# Altium schematic sheet PCIe_X16.SchDoc
size A3
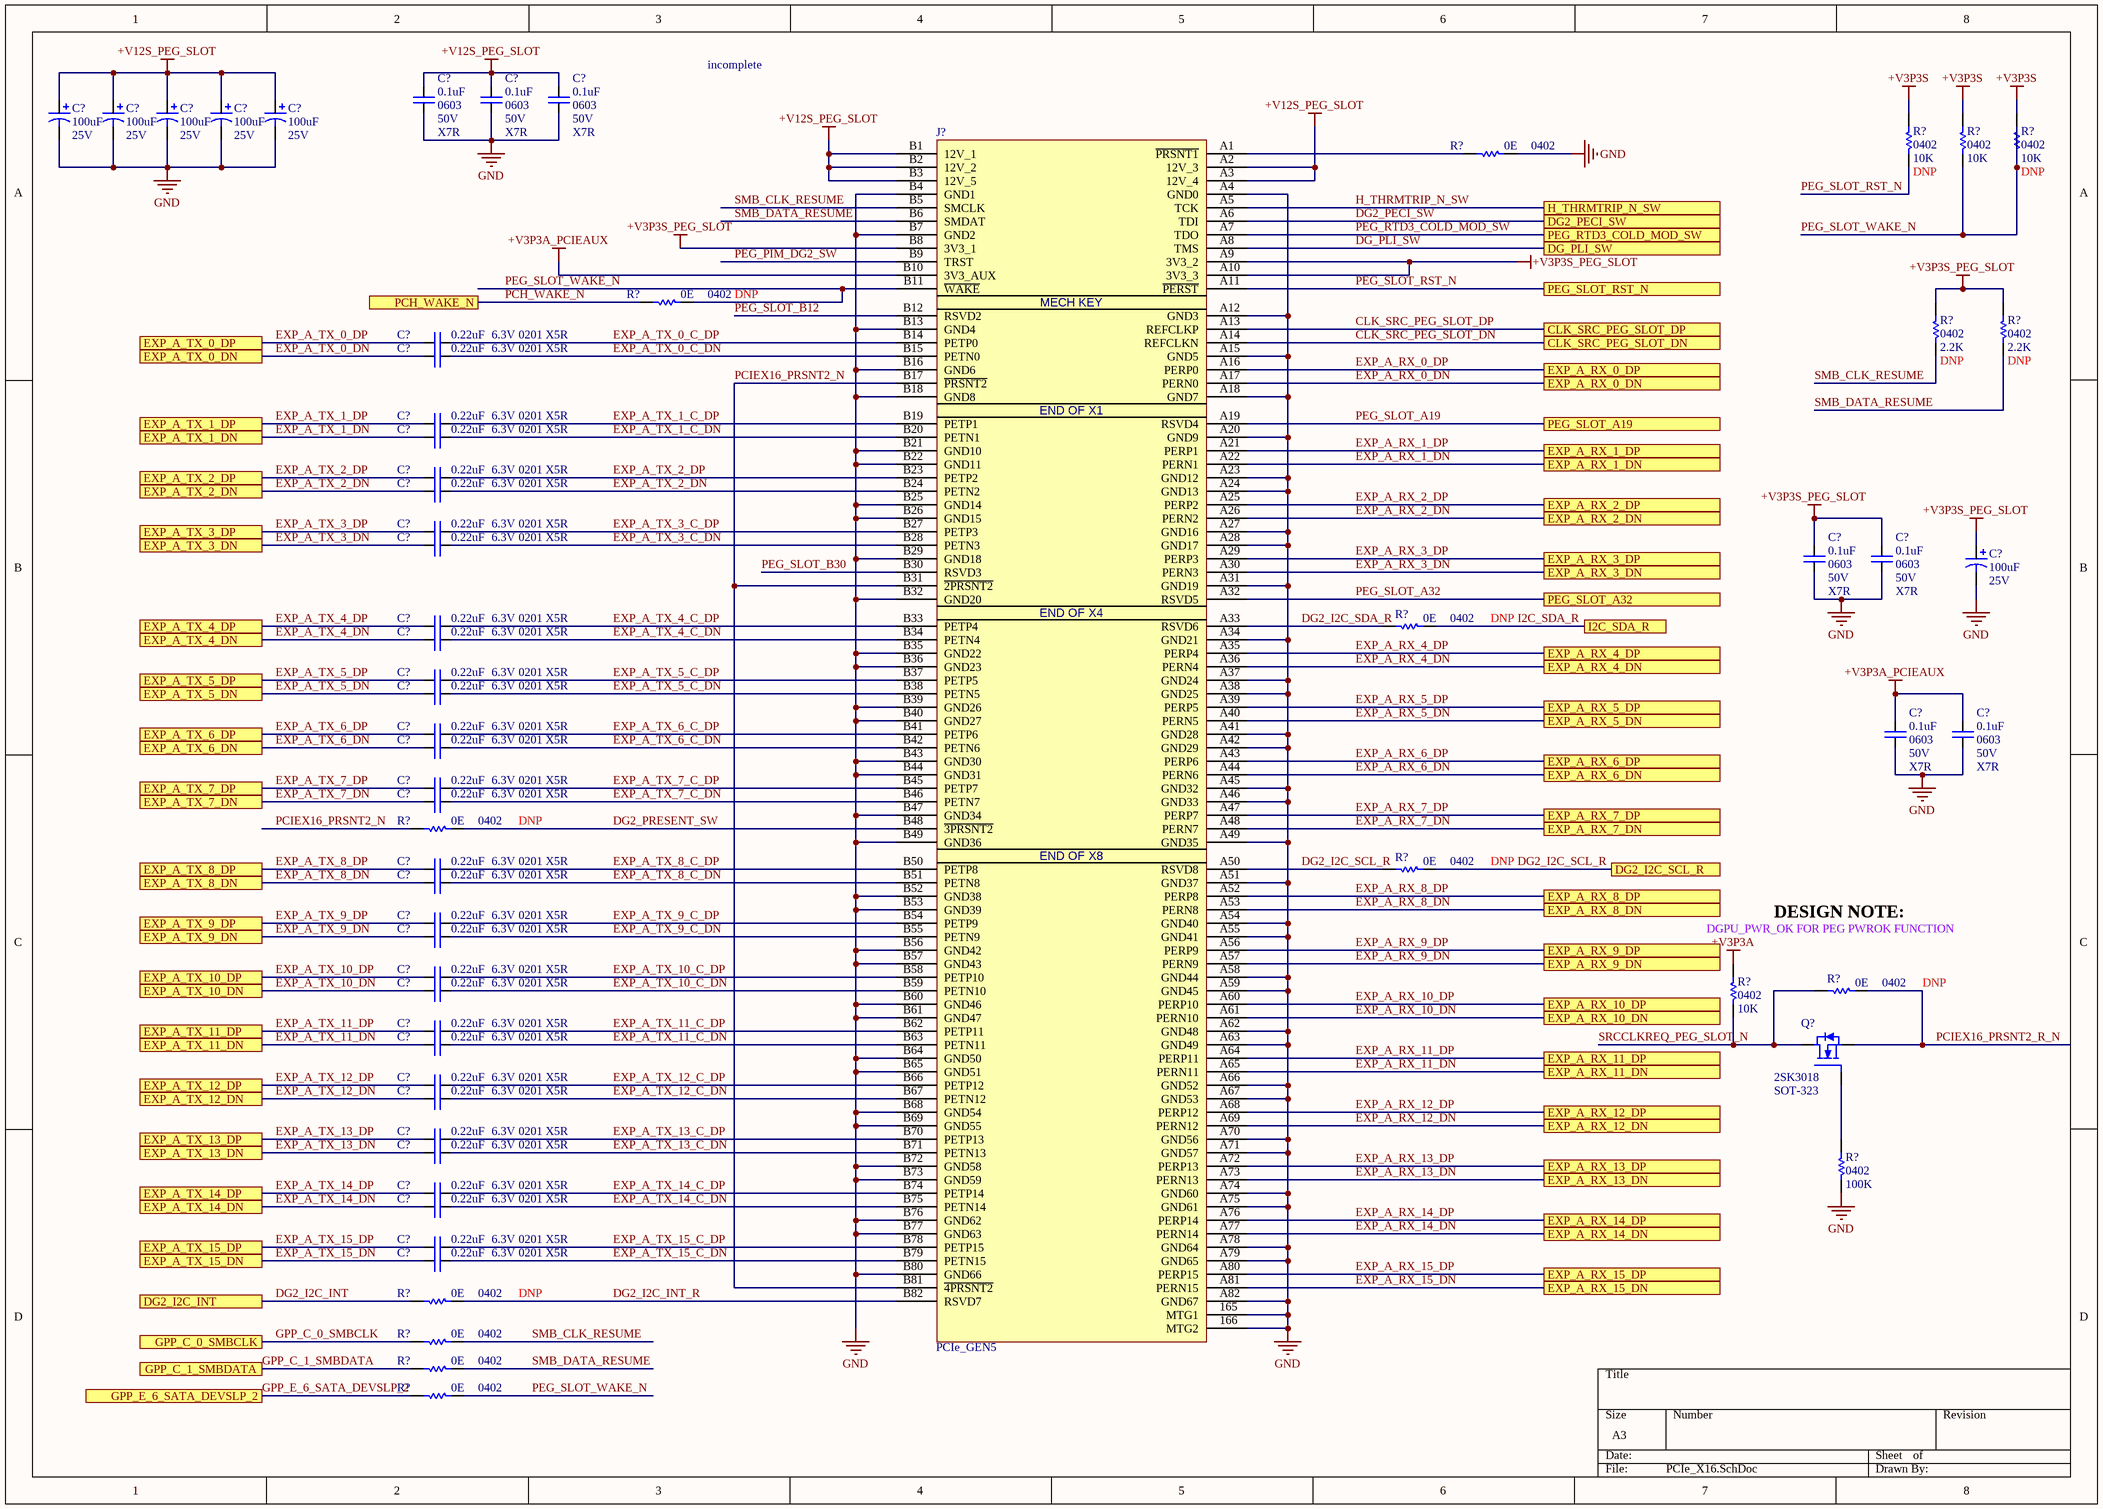
[diagram p0: PCIe_X16.SchDoc]

## Parts
(Parts that share a designator on the sheet are numbered #1, #2 ... from top to bottom, then left to right.)
C?#1  value 100uF  Voltage: 25V  (hidden comment: cap_polar)
C?#2  value 100uF  Voltage: 25V  (hidden comment: cap_polar)
C?#3  value 100uF  Voltage: 25V  (hidden comment: cap_polar)
C?#4  value 100uF  Voltage: 25V  (hidden comment: cap_polar)
C?#5  value 100uF  Voltage: 25V  (hidden comment: cap_polar)
C?#6  value 0.1uF  Case/Package: 0603  Voltage: 50V  Dielectric: X7R  [CAPC0201]
C?#7  value 0.1uF  Case/Package: 0603  Voltage: 50V  Dielectric: X7R  [CAPC0201]
C?#8  value 0.1uF  Case/Package: 0603  Voltage: 50V  Dielectric: X7R  [CAPC0201]
C?#9  value 0.22uF  Case/Package: 0201  Voltage: 6.3V  Dielectric: X5R  [CAPC0201]
C?#10  value 0.22uF  Case/Package: 0201  Voltage: 6.3V  Dielectric: X5R  [CAPC0201]
C?#11  value 0.22uF  Case/Package: 0201  Voltage: 6.3V  Dielectric: X5R  [CAPC0201]
C?#12  value 0.22uF  Case/Package: 0201  Voltage: 6.3V  Dielectric: X5R  [CAPC0201]
C?#13  value 0.22uF  Case/Package: 0201  Voltage: 6.3V  Dielectric: X5R  [CAPC0201]
C?#14  value 0.22uF  Case/Package: 0201  Voltage: 6.3V  Dielectric: X5R  [CAPC0201]
C?#15  value 0.22uF  Case/Package: 0201  Voltage: 6.3V  Dielectric: X5R  [CAPC0201]
C?#16  value 0.22uF  Case/Package: 0201  Voltage: 6.3V  Dielectric: X5R  [CAPC0201]
C?#17  value 100uF  Voltage: 25V  (hidden comment: cap_polar)
C?#18  value 0.1uF  Case/Package: 0603  Voltage: 50V  Dielectric: X7R  [CAPC0201]
C?#19  value 0.1uF  Case/Package: 0603  Voltage: 50V  Dielectric: X7R  [CAPC0201]
C?#20  value 0.22uF  Case/Package: 0201  Voltage: 6.3V  Dielectric: X5R  [CAPC0201]
C?#21  value 0.22uF  Case/Package: 0201  Voltage: 6.3V  Dielectric: X5R  [CAPC0201]
C?#22  value 0.22uF  Case/Package: 0201  Voltage: 6.3V  Dielectric: X5R  [CAPC0201]
C?#23  value 0.22uF  Case/Package: 0201  Voltage: 6.3V  Dielectric: X5R  [CAPC0201]
C?#24  value 0.22uF  Case/Package: 0201  Voltage: 6.3V  Dielectric: X5R  [CAPC0201]
C?#25  value 0.1uF  Case/Package: 0603  Voltage: 50V  Dielectric: X7R  [CAPC0201]
C?#26  value 0.1uF  Case/Package: 0603  Voltage: 50V  Dielectric: X7R  [CAPC0201]
C?#27  value 0.22uF  Case/Package: 0201  Voltage: 6.3V  Dielectric: X5R  [CAPC0201]
C?#28  value 0.22uF  Case/Package: 0201  Voltage: 6.3V  Dielectric: X5R  [CAPC0201]
C?#29  value 0.22uF  Case/Package: 0201  Voltage: 6.3V  Dielectric: X5R  [CAPC0201]
C?#30  value 0.22uF  Case/Package: 0201  Voltage: 6.3V  Dielectric: X5R  [CAPC0201]
C?#31  value 0.22uF  Case/Package: 0201  Voltage: 6.3V  Dielectric: X5R  [CAPC0201]
C?#32  value 0.22uF  Case/Package: 0201  Voltage: 6.3V  Dielectric: X5R  [CAPC0201]
C?#33  value 0.22uF  Case/Package: 0201  Voltage: 6.3V  Dielectric: X5R  [CAPC0201]
C?#34  value 0.22uF  Case/Package: 0201  Voltage: 6.3V  Dielectric: X5R  [CAPC0201]
C?#35  value 0.22uF  Case/Package: 0201  Voltage: 6.3V  Dielectric: X5R  [CAPC0201]
C?#36  value 0.22uF  Case/Package: 0201  Voltage: 6.3V  Dielectric: X5R  [CAPC0201]
C?#37  value 0.22uF  Case/Package: 0201  Voltage: 6.3V  Dielectric: X5R  [CAPC0201]
C?#38  value 0.22uF  Case/Package: 0201  Voltage: 6.3V  Dielectric: X5R  [CAPC0201]
C?#39  value 0.22uF  Case/Package: 0201  Voltage: 6.3V  Dielectric: X5R  [CAPC0201]
C?#40  value 0.22uF  Case/Package: 0201  Voltage: 6.3V  Dielectric: X5R  [CAPC0201]
C?#41  value 0.22uF  Case/Package: 0201  Voltage: 6.3V  Dielectric: X5R  [CAPC0201]
C?#42  value 0.22uF  Case/Package: 0201  Voltage: 6.3V  Dielectric: X5R  [CAPC0201]
C?#43  value 0.22uF  Case/Package: 0201  Voltage: 6.3V  Dielectric: X5R  [CAPC0201]
C?#44  value 0.22uF  Case/Package: 0201  Voltage: 6.3V  Dielectric: X5R  [CAPC0201]
C?#45  value 0.22uF  Case/Package: 0201  Voltage: 6.3V  Dielectric: X5R  [CAPC0201]
J?  PCIe_GEN5
Q?  Manufacturer Part Number: 2SK3018  Case/Package: SOT-323  [SOT323]  (hidden comment: MOSFET N_2SK3018)
R?#1  value 10K  Case/Package: 0402  [RESC0402]  (hidden comment: Res)
R?#2  value 10K  Case/Package: 0402  [RESC0402]  (hidden comment: Res)
R?#3  value 10K  Case/Package: 0402  [RESC0402]  (hidden comment: Res)
R?#4  value 0E  Case/Package: 0402  [RESC0402]  (hidden comment: Res)
R?#5  value 0E  Case/Package: 0402  [RESC0402]  (hidden comment: Res)
R?#6  value 2.2K  Case/Package: 0402  [RESC0402]  (hidden comment: Res)
R?#7  value 2.2K  Case/Package: 0402  [RESC0402]  (hidden comment: Res)
R?#8  value 0E  Case/Package: 0402  [RESC0402]  (hidden comment: Res)
R?#9  value 0E  Case/Package: 0402  [RESC0402]  (hidden comment: Res)
R?#10  value 0E  Case/Package: 0402  [RESC0402]  (hidden comment: Res)
R?#11  value 10K  Case/Package: 0402  [RESC0402]  (hidden comment: Res)
R?#12  value 0E  Case/Package: 0402  [RESC0402]  (hidden comment: Res)
R?#13  value 100K  Case/Package: 0402  [RESC0402]  (hidden comment: Res)
R?#14  value 0E  Case/Package: 0402  [RESC0402]  (hidden comment: Res)
R?#15  value 0E  Case/Package: 0402  [RESC0402]  (hidden comment: Res)
R?#16  value 0E  Case/Package: 0402  [RESC0402]  (hidden comment: Res)
R?#17  value 0E  Case/Package: 0402  [RESC0402]  (hidden comment: Res)

## Ports
CLK_SRC_PEG_SLOT_DN, CLK_SRC_PEG_SLOT_DP, DG2_I2C_INT, DG2_I2C_SCL_R, DG2_PECI_SW, DG_PLI_SW, EXP_A_RX_0_DN, EXP_A_RX_0_DP, EXP_A_RX_1_DN, EXP_A_RX_1_DP, EXP_A_RX_2_DN, EXP_A_RX_2_DP, EXP_A_RX_3_DN, EXP_A_RX_3_DP, EXP_A_RX_4_DN, EXP_A_RX_4_DP, EXP_A_RX_5_DN, EXP_A_RX_5_DP, EXP_A_RX_6_DN, EXP_A_RX_6_DP, EXP_A_RX_7_DN, EXP_A_RX_7_DP, EXP_A_RX_8_DN, EXP_A_RX_8_DP, EXP_A_RX_9_DN, EXP_A_RX_9_DP, EXP_A_RX_10_DN, EXP_A_RX_10_DP, EXP_A_RX_11_DN, EXP_A_RX_11_DP, EXP_A_RX_12_DN, EXP_A_RX_12_DP, EXP_A_RX_13_DN, EXP_A_RX_13_DP, EXP_A_RX_14_DN, EXP_A_RX_14_DP, EXP_A_RX_15_DN, EXP_A_RX_15_DP, EXP_A_TX_0_DN, EXP_A_TX_0_DP, EXP_A_TX_1_DN, EXP_A_TX_1_DP, EXP_A_TX_2_DN, EXP_A_TX_2_DP, EXP_A_TX_3_DN, EXP_A_TX_3_DP, EXP_A_TX_4_DN, EXP_A_TX_4_DP, EXP_A_TX_5_DN, EXP_A_TX_5_DP, EXP_A_TX_6_DN, EXP_A_TX_6_DP, EXP_A_TX_7_DN, EXP_A_TX_7_DP, EXP_A_TX_8_DN, EXP_A_TX_8_DP, EXP_A_TX_9_DN, EXP_A_TX_9_DP, EXP_A_TX_10_DN, EXP_A_TX_10_DP, EXP_A_TX_11_DN, EXP_A_TX_11_DP, EXP_A_TX_12_DN, EXP_A_TX_12_DP, EXP_A_TX_13_DN, EXP_A_TX_13_DP, EXP_A_TX_14_DN, EXP_A_TX_14_DP, EXP_A_TX_15_DN, EXP_A_TX_15_DP, GPP_C_0_SMBCLK, GPP_C_1_SMBDATA, GPP_E_6_SATA_DEVSLP_2, H_THRMTRIP_N_SW, I2C_SDA_R, PCH_WAKE_N, PEG_RTD3_COLD_MOD_SW, PEG_SLOT_A19, PEG_SLOT_A32, PEG_SLOT_RST_N

## Nets
+V3P3A: R?#11.1
+V3P3A_PCIEAUX: C?#25.1 C?#26.1 J?.B10(3V3_AUX)
+V3P3S: R?#1.2 R?#2.2 R?#3.2
+V3P3S_PEG_SLOT: C?#17.1(+) C?#18.1 C?#19.1 J?.A9(3V3_2) J?.A10(3V3_3) J?.B8(3V3_1) R?#6.2 R?#7.2
+V12S_PEG_SLOT: C?#1.1(+) C?#2.1(+) C?#3.1(+) C?#4.1(+) C?#5.1(+) C?#6.1 C?#7.1 C?#8.1 J?.A2(12V_3) J?.A3(12V_4) J?.B1(12V_1) J?.B2(12V_2) J?.B3(12V_5)
GND: C?#1.2 C?#2.2 C?#3.2 C?#4.2 C?#5.2 C?#6.2 C?#7.2 C?#8.2 C?#17.2 C?#18.2 C?#19.2 C?#25.2 C?#26.2 J?.165(MTG1) J?.166(MTG2) J?.A4(GND0) J?.A12(GND3) J?.A15(GND5) J?.A18(GND7) J?.A20(GND9) J?.A23(GND12) J?.A24(GND13) J?.A27(GND16) J?.A28(GND17) J?.A31(GND19) J?.A34(GND21) J?.A37(GND24) J?.A38(GND25) J?.A41(GND28) J?.A42(GND29) J?.A45(GND32) J?.A46(GND33) J?.A49(GND35) J?.A51(GND37) J?.A54(GND40) J?.A55(GND41) J?.A58(GND44) J?.A59(GND45) J?.A62(GND48) J?.A63(GND49) J?.A66(GND52) J?.A67(GND53) J?.A70(GND56) J?.A71(GND57) J?.A74(GND60) J?.A75(GND61) J?.A78(GND64) J?.A79(GND65) J?.A82(GND67) J?.B4(GND1) J?.B7(GND2) J?.B13(GND4) J?.B16(GND6) J?.B18(GND8) J?.B21(GND10) J?.B22(GND11) J?.B25(GND14) J?.B26(GND15) J?.B29(GND18) J?.B32(GND20) J?.B35(GND22) J?.B36(GND23) J?.B39(GND26) J?.B40(GND27) J?.B43(GND30) J?.B44(GND31) J?.B47(GND34) J?.B49(GND36) J?.B52(GND38) J?.B53(GND39) J?.B56(GND42) J?.B57(GND43) J?.B60(GND46) J?.B61(GND47) J?.B64(GND50) J?.B65(GND51) J?.B68(GND54) J?.B69(GND55) J?.B72(GND58) J?.B73(GND59) J?.B76(GND62) J?.B77(GND63) J?.B80(GND66) R?#4.1 R?#13.1
CLK_SRC_PEG_SLOT_DN: J?.A14(REFCLKN) ; port CLK_SRC_PEG_SLOT_DN
CLK_SRC_PEG_SLOT_DP: J?.A13(REFCLKP) ; port CLK_SRC_PEG_SLOT_DP
DG2_I2C_INT: R?#14.1 ; port DG2_I2C_INT
DG2_I2C_INT_R: J?.B82(RSVD7) R?#14.2
DG2_I2C_SCL_R: J?.A50(RSVD8) R?#10.1 R?#10.2 ; port DG2_I2C_SCL_R
DG2_I2C_SDA_R: J?.A33(RSVD6) R?#8.1
DG2_PECI_SW: J?.A6(TDI) ; port DG2_PECI_SW
DG2_PRESENT_SW: J?.B48(~{3PRSNT2}) R?#9.2
DG_PLI_SW: J?.A8(TMS) ; port DG_PLI_SW
EXP_A_RX_0_DN: J?.A17(PERN0) ; port EXP_A_RX_0_DN
EXP_A_RX_0_DP: J?.A16(PERP0) ; port EXP_A_RX_0_DP
EXP_A_RX_1_DN: J?.A22(PERN1) ; port EXP_A_RX_1_DN
EXP_A_RX_1_DP: J?.A21(PERP1) ; port EXP_A_RX_1_DP
EXP_A_RX_2_DN: J?.A26(PERN2) ; port EXP_A_RX_2_DN
EXP_A_RX_2_DP: J?.A25(PERP2) ; port EXP_A_RX_2_DP
EXP_A_RX_3_DN: J?.A30(PERN3) ; port EXP_A_RX_3_DN
EXP_A_RX_3_DP: J?.A29(PERP3) ; port EXP_A_RX_3_DP
EXP_A_RX_4_DN: J?.A36(PERN4) ; port EXP_A_RX_4_DN
EXP_A_RX_4_DP: J?.A35(PERP4) ; port EXP_A_RX_4_DP
EXP_A_RX_5_DN: J?.A40(PERN5) ; port EXP_A_RX_5_DN
EXP_A_RX_5_DP: J?.A39(PERP5) ; port EXP_A_RX_5_DP
EXP_A_RX_6_DN: J?.A44(PERN6) ; port EXP_A_RX_6_DN
EXP_A_RX_6_DP: J?.A43(PERP6) ; port EXP_A_RX_6_DP
EXP_A_RX_7_DN: J?.A48(PERN7) ; port EXP_A_RX_7_DN
EXP_A_RX_7_DP: J?.A47(PERP7) ; port EXP_A_RX_7_DP
EXP_A_RX_8_DN: J?.A53(PERN8) ; port EXP_A_RX_8_DN
EXP_A_RX_8_DP: J?.A52(PERP8) ; port EXP_A_RX_8_DP
EXP_A_RX_9_DN: J?.A57(PERN9) ; port EXP_A_RX_9_DN
EXP_A_RX_9_DP: J?.A56(PERP9) ; port EXP_A_RX_9_DP
EXP_A_RX_10_DN: J?.A61(PERN10) ; port EXP_A_RX_10_DN
EXP_A_RX_10_DP: J?.A60(PERP10) ; port EXP_A_RX_10_DP
EXP_A_RX_11_DN: J?.A65(PERN11) ; port EXP_A_RX_11_DN
EXP_A_RX_11_DP: J?.A64(PERP11) ; port EXP_A_RX_11_DP
EXP_A_RX_12_DN: J?.A69(PERN12) ; port EXP_A_RX_12_DN
EXP_A_RX_12_DP: J?.A68(PERP12) ; port EXP_A_RX_12_DP
EXP_A_RX_13_DN: J?.A73(PERN13) ; port EXP_A_RX_13_DN
EXP_A_RX_13_DP: J?.A72(PERP13) ; port EXP_A_RX_13_DP
EXP_A_RX_14_DN: J?.A77(PERN14) ; port EXP_A_RX_14_DN
EXP_A_RX_14_DP: J?.A76(PERP14) ; port EXP_A_RX_14_DP
EXP_A_RX_15_DN: J?.A81(PERN15) ; port EXP_A_RX_15_DN
EXP_A_RX_15_DP: J?.A80(PERP15) ; port EXP_A_RX_15_DP
EXP_A_TX_0_C_DN: C?#10.2 J?.B15(PETN0)
EXP_A_TX_0_C_DP: C?#9.2 J?.B14(PETP0)
EXP_A_TX_0_DN: C?#10.1 ; port EXP_A_TX_0_DN
EXP_A_TX_0_DP: C?#9.1 ; port EXP_A_TX_0_DP
EXP_A_TX_1_C_DN: C?#12.2 J?.B20(PETN1)
EXP_A_TX_1_C_DP: C?#11.2 J?.B19(PETP1)
EXP_A_TX_1_DN: C?#12.1 ; port EXP_A_TX_1_DN
EXP_A_TX_1_DP: C?#11.1 ; port EXP_A_TX_1_DP
EXP_A_TX_2_DN: C?#14.1 C?#14.2 J?.B24(PETN2) ; port EXP_A_TX_2_DN
EXP_A_TX_2_DP: C?#13.1 C?#13.2 J?.B23(PETP2) ; port EXP_A_TX_2_DP
EXP_A_TX_3_C_DN: C?#16.2 J?.B28(PETN3)
EXP_A_TX_3_C_DP: C?#15.2 J?.B27(PETP3)
EXP_A_TX_3_DN: C?#16.1 ; port EXP_A_TX_3_DN
EXP_A_TX_3_DP: C?#15.1 ; port EXP_A_TX_3_DP
EXP_A_TX_4_C_DN: C?#21.2 J?.B34(PETN4)
EXP_A_TX_4_C_DP: C?#20.2 J?.B33(PETP4)
EXP_A_TX_4_DN: C?#21.1 ; port EXP_A_TX_4_DN
EXP_A_TX_4_DP: C?#20.1 ; port EXP_A_TX_4_DP
EXP_A_TX_5_C_DN: C?#23.2 J?.B38(PETN5)
EXP_A_TX_5_C_DP: C?#22.2 J?.B37(PETP5)
EXP_A_TX_5_DN: C?#23.1 ; port EXP_A_TX_5_DN
EXP_A_TX_5_DP: C?#22.1 ; port EXP_A_TX_5_DP
EXP_A_TX_6_C_DN: C?#27.2 J?.B42(PETN6)
EXP_A_TX_6_C_DP: C?#24.2 J?.B41(PETP6)
EXP_A_TX_6_DN: C?#27.1 ; port EXP_A_TX_6_DN
EXP_A_TX_6_DP: C?#24.1 ; port EXP_A_TX_6_DP
EXP_A_TX_7_C_DN: C?#29.2 J?.B46(PETN7)
EXP_A_TX_7_C_DP: C?#28.2 J?.B45(PETP7)
EXP_A_TX_7_DN: C?#29.1 ; port EXP_A_TX_7_DN
EXP_A_TX_7_DP: C?#28.1 ; port EXP_A_TX_7_DP
EXP_A_TX_8_C_DN: C?#31.2 J?.B51(PETN8)
EXP_A_TX_8_C_DP: C?#30.2 J?.B50(PETP8)
EXP_A_TX_8_DN: C?#31.1 ; port EXP_A_TX_8_DN
EXP_A_TX_8_DP: C?#30.1 ; port EXP_A_TX_8_DP
EXP_A_TX_9_C_DN: C?#33.2 J?.B55(PETN9)
EXP_A_TX_9_C_DP: C?#32.2 J?.B54(PETP9)
EXP_A_TX_9_DN: C?#33.1 ; port EXP_A_TX_9_DN
EXP_A_TX_9_DP: C?#32.1 ; port EXP_A_TX_9_DP
EXP_A_TX_10_C_DN: C?#35.2 J?.B59(PETN10)
EXP_A_TX_10_C_DP: C?#34.2 J?.B58(PETP10)
EXP_A_TX_10_DN: C?#35.1 ; port EXP_A_TX_10_DN
EXP_A_TX_10_DP: C?#34.1 ; port EXP_A_TX_10_DP
EXP_A_TX_11_C_DN: C?#37.2 J?.B63(PETN11)
EXP_A_TX_11_C_DP: C?#36.2 J?.B62(PETP11)
EXP_A_TX_11_DN: C?#37.1 ; port EXP_A_TX_11_DN
EXP_A_TX_11_DP: C?#36.1 ; port EXP_A_TX_11_DP
EXP_A_TX_12_C_DN: C?#39.2 J?.B67(PETN12)
EXP_A_TX_12_C_DP: C?#38.2 J?.B66(PETP12)
EXP_A_TX_12_DN: C?#39.1 ; port EXP_A_TX_12_DN
EXP_A_TX_12_DP: C?#38.1 ; port EXP_A_TX_12_DP
EXP_A_TX_13_C_DN: C?#41.2 J?.B71(PETN13)
EXP_A_TX_13_C_DP: C?#40.2 J?.B70(PETP13)
EXP_A_TX_13_DN: C?#41.1 ; port EXP_A_TX_13_DN
EXP_A_TX_13_DP: C?#40.1 ; port EXP_A_TX_13_DP
EXP_A_TX_14_C_DN: C?#43.2 J?.B75(PETN14)
EXP_A_TX_14_C_DP: C?#42.2 J?.B74(PETP14)
EXP_A_TX_14_DN: C?#43.1 ; port EXP_A_TX_14_DN
EXP_A_TX_14_DP: C?#42.1 ; port EXP_A_TX_14_DP
EXP_A_TX_15_C_DN: C?#45.2 J?.B79(PETN15)
EXP_A_TX_15_C_DP: C?#44.2 J?.B78(PETP15)
EXP_A_TX_15_DN: C?#45.1 ; port EXP_A_TX_15_DN
EXP_A_TX_15_DP: C?#44.1 ; port EXP_A_TX_15_DP
GPP_C_0_SMBCLK: R?#15.1 ; port GPP_C_0_SMBCLK
GPP_C_1_SMBDATA: R?#16.1 ; port GPP_C_1_SMBDATA
GPP_E_6_SATA_DEVSLP_2: R?#17.1 ; port GPP_E_6_SATA_DEVSLP_2
H_THRMTRIP_N_SW: J?.A5(TCK) ; port H_THRMTRIP_N_SW
I2C_SDA_R: R?#8.2 ; port I2C_SDA_R
PCH_WAKE_N: R?#5.1 ; port PCH_WAKE_N
PCIEX16_PRSNT2_N: J?.B17(~{PRSNT2}) J?.B31(~{2PRSNT2}) J?.B81(~{4PRSNT2}) R?#9.1
PCIEX16_PRSNT2_R_N: Q?.2(SOURCE) R?#12.1
PEG_PIM_DG2_SW: J?.B9(TRST)
PEG_RTD3_COLD_MOD_SW: J?.A7(TDO) ; port PEG_RTD3_COLD_MOD_SW
PEG_SLOT_A19: J?.A19(RSVD4) ; port PEG_SLOT_A19
PEG_SLOT_A32: J?.A32(RSVD5) ; port PEG_SLOT_A32
PEG_SLOT_B12: J?.B12(RSVD2)
PEG_SLOT_B30: J?.B30(RSVD3)
PEG_SLOT_RST_N: J?.A11(~{PERST}) R?#1.1 ; port PEG_SLOT_RST_N
PEG_SLOT_WAKE_N: J?.B11(~{WAKE}) R?#2.1 R?#3.1 R?#5.2 R?#17.2
SMB_CLK_RESUME: J?.B5(SMCLK) R?#6.1 R?#15.2
SMB_DATA_RESUME: J?.B6(SMDAT) R?#7.1 R?#16.2
SRCCLKREQ_PEG_SLOT_N: Q?.3(DRAIN) R?#11.2 R?#12.2
NetJ?_A1: J?.A1(~{PRSNT1}) R?#4.2
NetQ?_1: Q?.1(GATE) R?#13.2

## Notes on the sheet
- incomplete
- DESIGN NOTE:
- (near R?#11) DGPU_PWR_OK FOR PEG PWROK FUNCTION
- (in symbol PCIe_GEN5) MECH KEY; END OF X1; END OF X4; END OF X8

## Library data of the parts
C?#1-C?#5 C?#17 = cap_polar: CAP CER 100uF 25V; Manufacturer Part Number: *; Case/Package: *; Dielectric: *
C?#6-C?#8 C?#18 C?#19 C?#25 C?#26 = Cap: CAP CER 0.1uF 50V X7R 0603
C?#9-C?#16 C?#20-C?#24 C?#27-C?#45 = Cap: CAP CER 0.22uF 6.3V X5R 0201
Q? = MOSFET N_2SK3018: NMOS,2SK3018,SOT_323,Id=0.1A,Vds=30V
R?#1-R?#3 = Res: Thick Film Resistor - 10Kohm, 1%, 0402
  R?#1 R?#3: DNP: DNP
R?#4 R?#5 R?#8-R?#10 R?#12 R?#14-R?#17 = Res: Thick Film Resistor -  0ohm, 1%, 0402
  R?#5 R?#8-R?#10 R?#12 R?#14: DNP: DNP
R?#6 R?#7 = Res: Thick Film Resistor - 2.2Kohm, 1%, 0402; DNP: DNP
R?#11 = Res: Thick Film Resistor -  10Kohm, 1%, 0402
R?#13 = Res: Thick Film Resistor - 100Kohm, 1%, 0402